# EAGLE design Ivy Sensor (EAGLE 7.6.0)
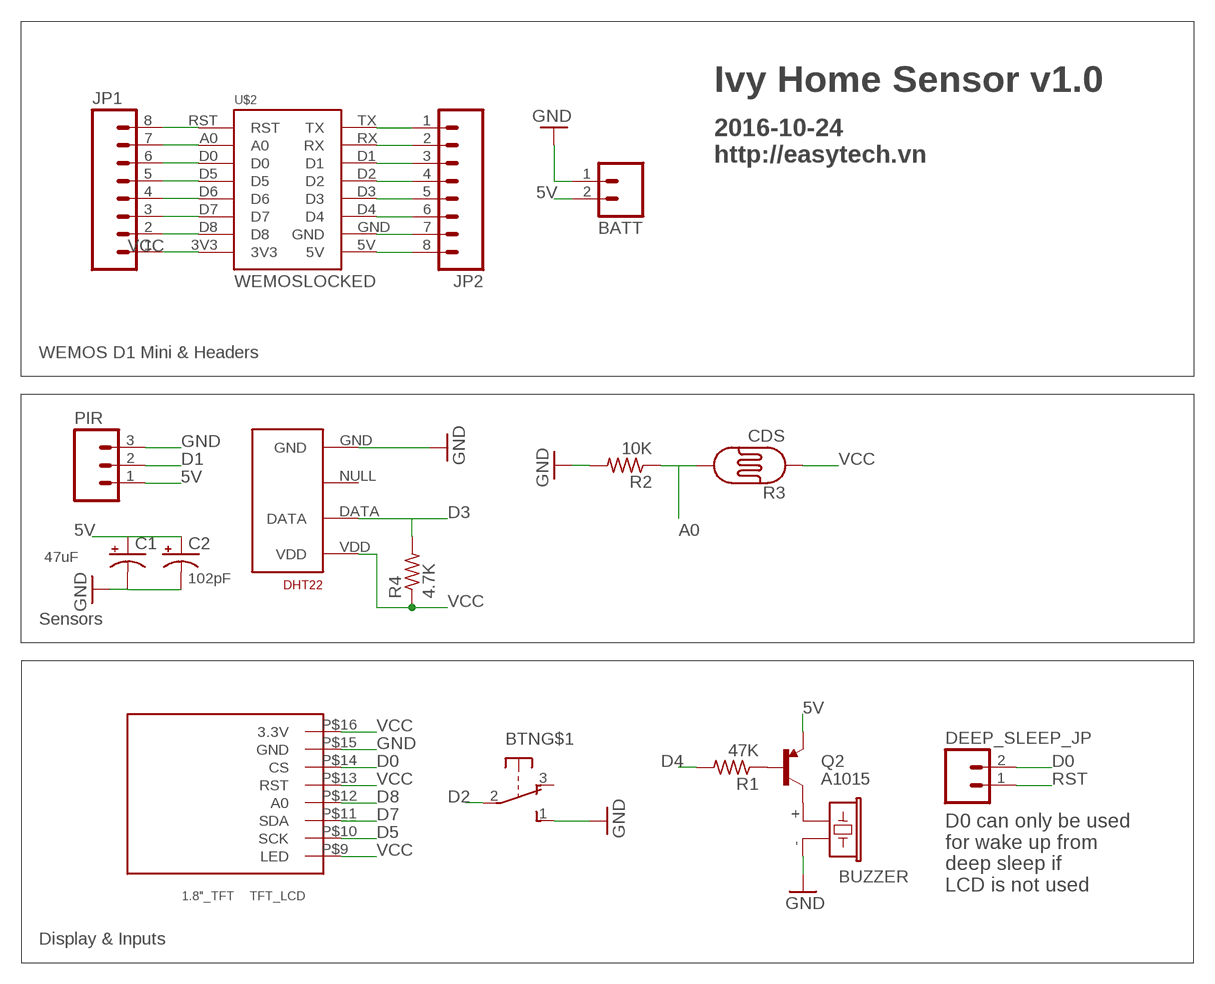
[diagram p0: schematic, sheet 1]

## Parts
BATT  M02PTH  [1X02]
BTN  OS102011MA1Q  [OS102011MA1Q]
BUZZER  F/CM12P  [F/CM12P]
C1  47uF  CAP_POLPTH2  [CPOL-RADIAL-10UF-25V]
C2  102pF  CAP_POLPTH2  [CPOL-RADIAL-10UF-25V]
DEEP_SLEEP_JP  M02PTH  [1X02]
DHT22  RHT03_DHT-22_AM2302RA  [RHT03_DHT-22/RA]
JP1  M08  [1X08_ROUND]
JP2  M08  [1X08_ROUND]
PIR  M03PTH  [1X03]
Q2  A1015  TRANSISTOR_PNPSMD  [SOT23-3]
R1  47K  R-US_R0805  [R0805]
R2  10K  R-US_R0805  [R0805]
R3  CDS  PHOTOCELL  [PHOTOCELL_THIN]
R4  4.7K  R-US_R0805  [R0805]
TFT_LCD  1.8"_TFT  [1.8"_TFT]
U$2  WEMOSLOCKED  [WEMOS_LOCKED]

## Nets
5V: BATT.2 C1.1(+) C2.1(+) JP2.8 PIR.1 Q2.2(E) U$2.5V
A0: JP1.7 R2.1 R3.2 U$2.A0
D0: DEEP_SLEEP_JP.2 JP1.6 TFT_LCD.P$14(CS) U$2.D0
D1: JP2.3 PIR.2 U$2.D1
D2: BTN.2(P) JP2.4 U$2.D2
D3: DHT22.DATA JP2.5 R4.2 U$2.D3
D4: JP2.6 R1.2 U$2.D4
D5: JP1.5 TFT_LCD.P$10(SCK) U$2.D5
D6: JP1.4 U$2.D6
D7: JP1.3 TFT_LCD.P$11(SDA) U$2.D7
D8: JP1.2 TFT_LCD.P$12(A0) U$2.D8
GND: BATT.1 BTN.1(S) BUZZER.- C1.2(-) C2.2(-) DHT22.GND JP2.7 PIR.3 R2.2 TFT_LCD.P$15(GND) U$2.GND
RST: DEEP_SLEEP_JP.1 JP1.8 U$2.RST
RX: JP2.2 U$2.RX
T_B: Q2.1(B) R1.1
T_C: BUZZER.+ Q2.3(C)
TX: JP2.1 U$2.TX
VCC: DHT22.VDD JP1.1 R3.1 R4.1 TFT_LCD.P$9(LED) TFT_LCD.P$13(RST) TFT_LCD.P$16(3.3V) U$2.3V3
Unconnected: BTN.3(O) BTN.MT1(MT) BTN.MT2(MT) DHT22.NULL

## Notes on the sheet
- Ivy Home Sensor v1.0
- 2016-10-24
  http://easytech.vn
- WEMOS D1 Mini & Headers
- Sensors
- D0 can only be used
  for wake up from 
  deep sleep if 
  LCD is not used
- Display & Inputs

## Library data of the parts
BATT DEEP_SLEEP_JP = SparkFun-Connectors:M02: Standard 2-pin 0.1" header. Use with - straight break away headers ( PRT-00116) - right angle break away headers (PRT-00553) - swiss pins (PRT-00743) - machine pins (PRT-00117) - female headers (PRT-00115) Molex polarized connector foot print use with: PRT-08233 with associated crimp pins and housings. 2.54_SCREWTERM for use with PRT-10571. 3.5mm Screw Terminal footprints for PRT-08084 5mm Screw Terminal footprints for use with PRT-08432
BTN = adafruit:OS102011MA1Q: OS10201MA1Q through-hole right angle switch http://www.ladyada.net/library/eagle
BUZZER = buzzer:F/CM12P: BUZZER Source: Buerklin; OC_FARNELL: unknown; OC_NEWARK: unknown
C1 C2 = SparkFun-Capacitors:CAP_POL: Capacitor Polarized These are standard SMD and PTH capacitors. Normally 10uF, 47uF, and 100uF in electrolytic and tantalum varieties. Always verify the external diameter of the through hole cap, it varies with capacity, voltage, and manufacturer. The EIA devices should be standard.
DHT22 = RHT03_DHT-22_AM2302:RHT03_DHT-22_AM2302: RHT03 / DHT-22 / AM2302 Packages and symbol for the RHT03 / DHT-22 relative humidity and temperature sensor. Note: The AM2302 is a wired version of the DHT-22 which typically requires less clearance and is thus provided as a separate package.; PROD_ID: SEN-10167
JP1 JP2 = SparkFun-Connectors:M08: Header 8 Standard 8-pin 0.1" header. Use with straight break away headers (SKU : PRT-00116), right angle break away headers (PRT-00553), swiss pins (PRT-00743), machine pins (PRT-00117), and female headers (PRT-00115).
PIR = SparkFun-Connectors:M03: Header 3 Standard 3-pin 0.1" header. Use with straight break away headers (SKU : PRT-00116), right angle break away headers (PRT-00553), swiss pins (PRT-00743), machine pins (PRT-00117), and female headers (PRT-00115). Molex polarized connector foot print use with SKU : PRT-08232 with associated crimp pins and housings.
Q2 = SparkFun-DiscreteSemi:TRANSISTOR_PNP: Generic PNP BJT Double check pinouts against datasheets- not all devices are the same! MMBT3906 - 40V 200mA SOT-23 (TRANS-08052) MMBT4403 - 40V 600mA SOT-23 (TRANS-09245)
R1 R2 R4 = resistor:R-US_: RESISTOR, American symbol
R3 = SparkFun-Sensors:PHOTOCELL: CdS photoresistor. This is a low cost way to detect light levels. Resistance decreases with more incoming light. SparkFun SKU: SEN-09088
TFT_LCD = tft_1.8_1.44_oled_0.96:1.8"_TFT
U$2 = My Eagle Lib:WEMOS

## Board
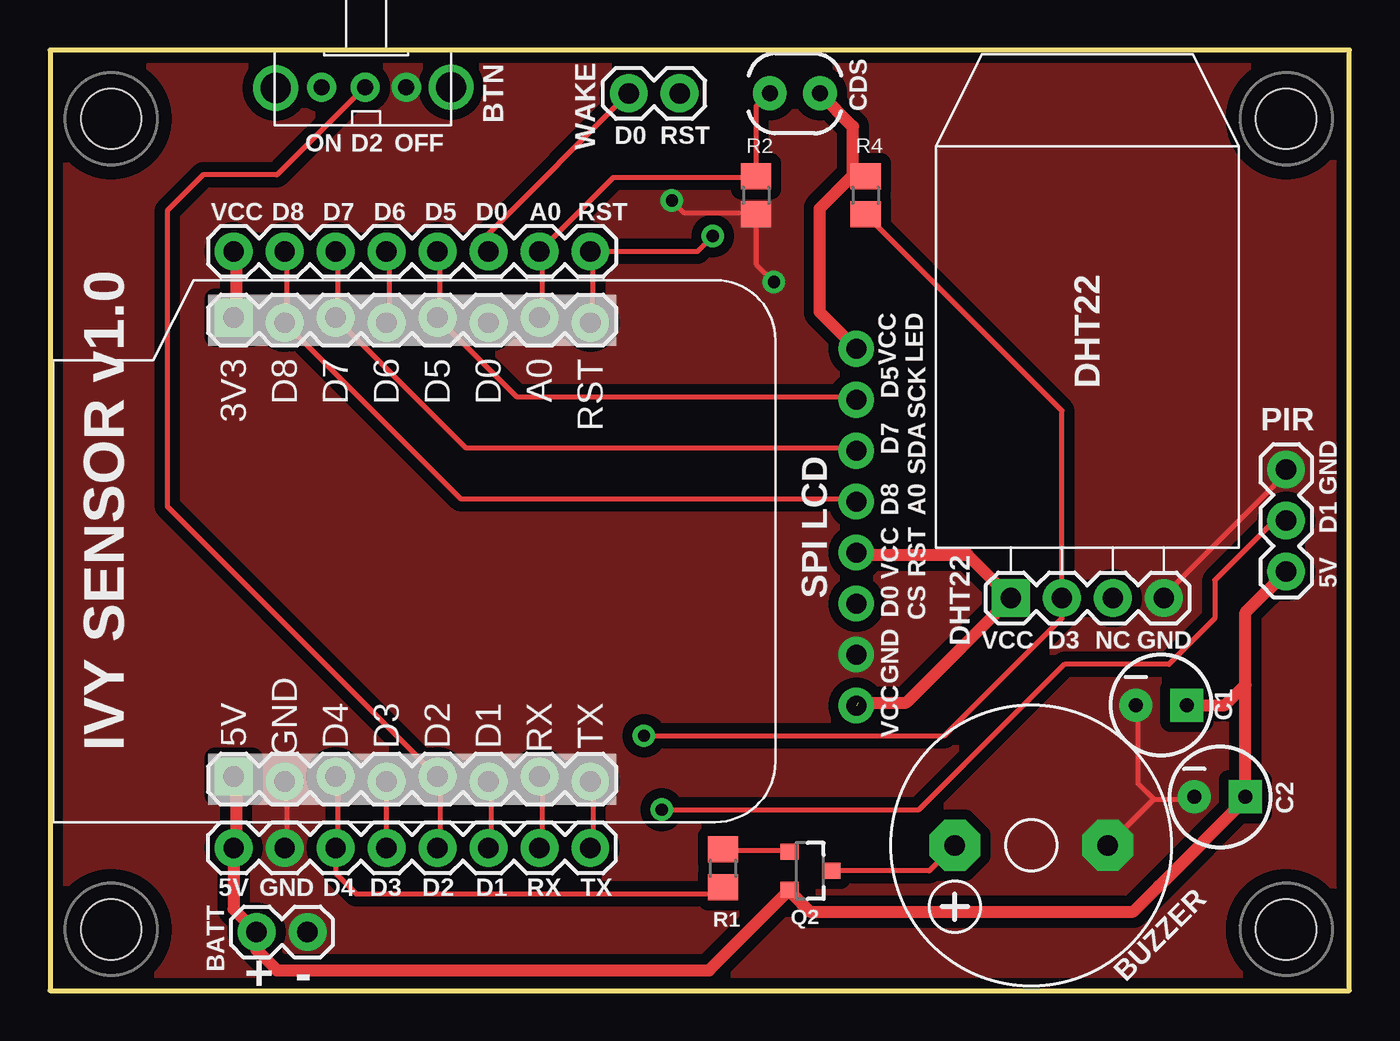
[diagram p1: board, top side]
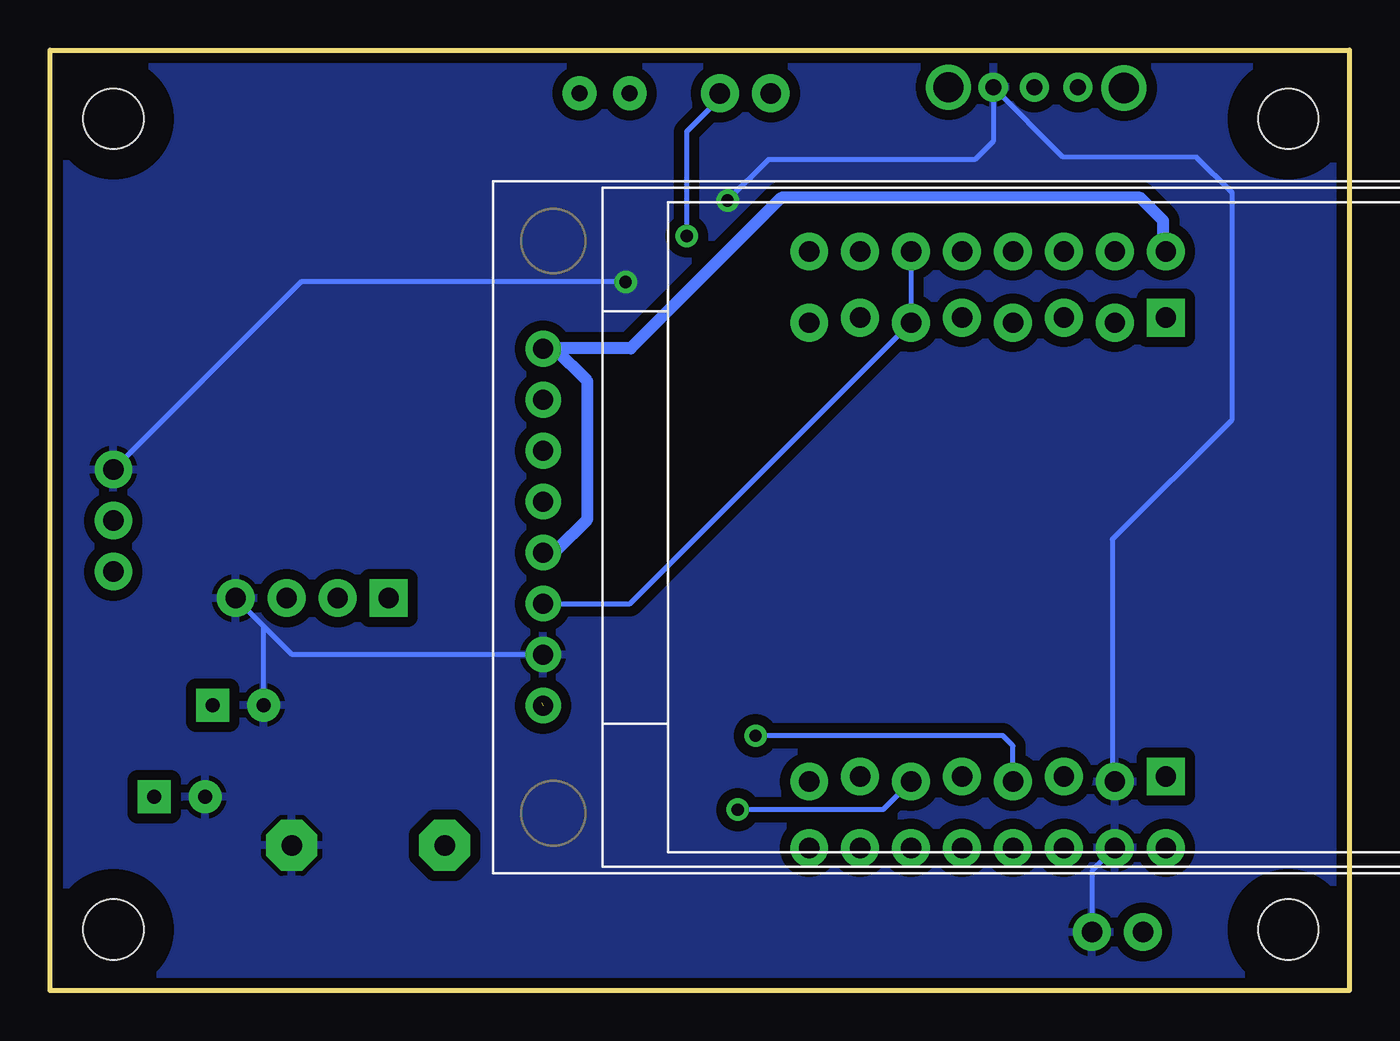
[diagram p2: board, bottom side, seen from below]

Size 64.74 x 46.85 mm. Coordinates in mm from the lower left corner, seen from the top.
Outline: 0,0 64.74,0 64.74,46.85 0,46.85 0,0
Copper layers (1*16): Top 0.035mm / dielectric 1.5mm / Bottom 0.035mm
Design rules "default *": minimum track width 10mil, minimum drill 24mil, track to track 10mil, track to pad 10mil, pad to pad 10mil, via to via 10mil, smd to smd 8mil, copper to edge 20mil, drill to drill 12mil, minimum pad ring 13mil, minimum via ring 10mil, stop-mask expansion 4mil, vias tented up to drill 0mil, thermal gap 10mil

### Footprints (pad centres in the part's own frame; a part is rotated, then mirrored left to right if it is on the bottom)
1X02 = drill 1.016 pad 1.88: 1 0,0; 2 2.54,0
OS102011MA1Q = drill 0.8 pad 1.422: 1 -2.762,0; 2 -0.711,0; 3 1.456,0 | drill 1.5 pad 2.184: MT1 -4.989,0; MT2 3.756,0.038
F/CM12P = drill 1.016 pad 2.54 octagon: + 3.81,0; - -3.81,0
CPOL-RADIAL-10UF-25V = drill 0.7 pad 1.651 square: 1 1.27,0 | drill 0.7 pad 1.651: 2 -1.27,0
RHT03_DHT-22/RA = drill 1.016 pad 1.88: DATA -1.27,0; GND 3.81,0; NULL 1.27,0 | drill 1.016 pad 1.88 square: VDD -3.81,0
1X08_ROUND = drill 1.016 pad 1.88: 1 0,0; 2 2.54,0; 3 5.08,0; 4 7.62,0; 5 10.16,0; 6 12.7,0; 7 15.24,0; 8 17.78,0
1X03 = drill 1.016 pad 1.88: 1 0,0; 2 2.54,0; 3 5.08,0
SOT23-3 = smd 0.8 x 0.9: 1 -0.95,-1; 2 0.95,-1; 3 0,1.1
R0805 = smd 1.3 x 1.5: 1 -0.95,0; 2 0.95,0
PHOTOCELL_THIN = drill 0.8 pad 1.676: 1 -1.15,0; 2 1.35,0
1.8"_TFT = drill 1 pad 1.778: P$9 2.5,26.14; P$10 2.5,23.6; P$11 2.5,21.06; P$12 2.5,18.52; P$13 2.5,15.98; P$14 2.5,13.44; P$15 2.5,10.9; P$16 2.5,8.36
WEMOS_LOCKED = drill 1.016 pad 1.88 square: 3V3 -0.127,0; 5V 22.733,0 | drill 1.016 pad 1.88: A0 -0.127,15.24; D0 0.127,12.7; D1 22.987,12.7; D2 22.733,10.16; D3 22.987,7.62; D4 22.733,5.08; D5 -0.127,10.16; D6 0.127,7.62; D7 -0.127,5.08; D8 0.127,2.54; GND 22.987,2.54; RST 0.127,17.78; RX 22.733,15.24; TX 22.987,17.78
KFH-M3 = hole 3: 0,0

### Placement (x,y rotation side)
BATT  12.83,2.92 180 top
BTN  14.99,45.01 180 top
BUZZER  48.89,7.24 180 top
C1  55.37,14.22 0 top
C2  58.29,9.65 0 top
DEEP_SLEEP_JP  31.37,44.7 180 top
DHT22  51.69,19.56 0 top
JP1  9.14,36.83 0 top
JP2  26.92,7.11 180 top
PIR  61.59,20.88 90 top
Q2  37.85,5.97 270 top
R1  33.53,6.1 270 top
R2  35.18,39.62 270 top
R3  37.21,44.7 180 top
R4  40.64,39.62 270 top
TFT_LCD  42.67,5.84 0 bottom
U$2  9.14,33.4 270 top
U$6  [KFH-M3]  3.05,3.05 0 top
U$7  [KFH-M3]  61.59,3.05 0 top
U$8  [KFH-M3]  61.59,43.43 0 top
U$9  [KFH-M3]  3.05,43.43 0 top

### Tracks (layer width: path | path; a pad name or v marks a point on that pad's centre or on a via)
5V
  Top 0.254: 9.27,7.24 JP2.8 | 9.27,10.54 U$2.5V | 36.96,4.95 Q2.2 36.7,4.95 | 59.56,9.53 C2.1 59.56,9.78
  Top 0.61: 9.27,10.54 9.27,7.24 | 59.56,9.53 55.24,5.21 54.99,4.95 53.97,3.94 37.85,3.94 36.96,4.83 36.96,4.95 | JP2.8 9.14,4.06 BATT.2 10.29,2.03 11.3,1.02 32.84,1.02 Q2.2 | 59.56,9.78 59.56,15.24 | 59.56,15.24 59.56,18.85 PIR.1 | C1.1 58.55,14.22 59.56,15.24
A0
  Top 0.254: R3.2 35.69,44.58 35.18,44.07 R2.1 35.18,40.51 28.07,40.51 JP1.7 24.51,36.7 24.51,33.66 U$2.A0
D0
  Top 0.254: DEEP_SLEEP_JP.2 21.84,37.72 JP1.6
  Bottom 0.254: TFT_LCD.P$14 35.84,19.28 U$2.D0 JP1.6
D1  (via drill 0.61)
  Top 0.254: JP2.3 21.97,7.24 21.97,10.29 U$2.D1 | v30.48,9.02 43.31,9.02 50.55,16.26 55.75,16.26 58.04,18.54 58.04,20.45 60.83,23.24 61.59,23.24 PIR.2
  Bottom 0.254: v30.48,9.02 23.24,9.02 U$2.D1
D2
  Top 0.254: JP2.4 19.43,7.24 19.43,10.54 U$2.D2 5.84,24.13 5.84,38.86 7.62,40.64 11.3,40.64 15.67,45.01 BTN.2
D3  (via drill 0.61)
  Top 0.254: R4.2 50.42,28.9 DHT22.DATA 50.42,18.54 44.58,12.7 v29.59,12.7 | JP2.5 U$2.D3
  Bottom 0.254: U$2.D3 16.76,12.19 17.27,12.7 v29.59,12.7
D4
  Top 0.254: 33.4,5.21 R1.2 33.21,4.83 15.24,4.83 14.22,5.84 JP2.6 14.35,7.24 14.35,10.54 U$2.D4
D5
  Top 0.254: TFT_LCD.P$10 40,29.59 23.24,29.59 U$2.D5 19.43,33.66 19.43,36.7 JP1.5
D6
  Top 0.254: U$2.D6 16.89,33.4 16.89,36.7 JP1.4
D7
  Top 0.254: TFT_LCD.P$11 40,27.05 20.7,27.05 U$2.D7 14.35,33.66 14.35,36.7 JP1.3
D8
  Top 0.254: TFT_LCD.P$12 40,24.51 20.45,24.51 U$2.D8 11.81,33.4 11.81,36.7 JP1.2
GND  (via drill 0.61)
  Top 0.254: JP2.7 11.81,7.24 11.81,10.29 U$2.GND | 54.99,9.53 57.02,9.53 C2.2 | BUZZER.- 54.99,9.53 | 54.99,9.53 54.23,10.29 54.23,14.1 C1.2 | PIR.3 61.59,25.78 55.5,19.68 DHT22.GND | v30.99,39.37 31.62,38.73 35.12,38.73 R2.2 35.18,36.2 v36.07,35.31
  Bottom 0.254: BATT.1 12.83,5.97 JP2.7 | v30.99,39.37 28.96,41.4 18.67,41.4 17.75,42.32 BTN.1 14.27,41.53 7.62,41.53 5.84,39.75 5.84,28.45 11.81,22.48 11.81,10.54 U$2.GND | TFT_LCD.P$15 52.68,16.74 DHT22.GND 54.1,18.16 C1.2 | v36.07,35.31 52.25,35.31 PIR.3
  pour Bottom (isolate 0.508): -17.91,50.93 69.98,51.56 69.98,-3.68 -17.91,-4.32
  pour Top (isolate 0.508, no thermals): -17.91,50.93 69.98,51.56 69.98,-3.68 -17.91,-4.32
RST  (via drill 0.61)
  Top 0.254: U$2.RST 27.05,33.4 27.05,36.7 JP1.8 32.26,36.83 v33.02,37.59
  Bottom 0.254: DEEP_SLEEP_JP.1 31.37,44.45 33.02,42.8 v33.02,37.59
RX
  Top 0.254: JP2.2 24.51,7.24 24.51,10.54 U$2.RX
T_B
  Top 0.254: Q2.1 36.7,6.98 33.66,6.98 R1.1
T_C
  Top 0.254: Q2.3 43.81,5.97 BUZZER.+
TX
  Top 0.254: JP2.1 27.05,7.24 27.05,10.29 U$2.TX
VCC  (1 unrouted)
  Top 0.254: 40.26,21.72 TFT_LCD.P$13 | 47.88,19.68 DHT22.VDD | 9.27,33.66 U$2.3V3 | 9.27,36.7 JP1.1 | 40.02,40.63 R4.1
  Top 0.61: 9.27,36.7 9.27,33.66 | R3.1 40.02,43.05 40.02,40.63 38.35,38.97 38.35,33.8 TFT_LCD.P$9 | 40.26,14.35 42.67,14.35 DHT22.VDD 45.72,21.72 40.26,21.72
  Bottom 0.254: 9.27,36.96 JP1.1 | 40,21.97 TFT_LCD.P$13
  Bottom 0.61: 9.27,36.96 9.27,38.35 10.41,39.5 28.32,39.5 35.81,32 39.62,32 | 39.62,32 40.15,32 TFT_LCD.P$9 | 40,21.97 39.5,21.97 37.97,23.5 37.97,30.35 39.62,32

### Text on the board
tNames: WAKE | D0 | RST | ON | D2 | OFF | VCC | D8 | D7 | D6 | D5 | D0 | A0 | RST | VCC / LED | D5 / SCK | D7 / SDA | GND | D8 / A0 | D1 | VCC / RST | DHT22 | 5V | D0 / CS | SPI LCD | GND | VCC | D3 | NC | GND | VCC | IVY SENSOR v1.0 | D3 | 5V | GND | D4 | D2 | D1 | RX | TX | + | -